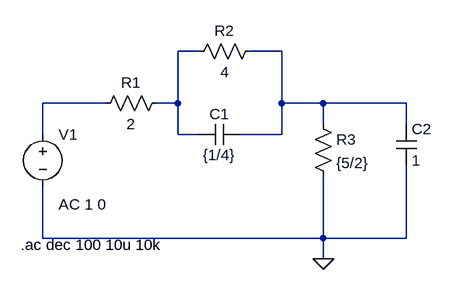
[diagram p0: schematic 2.asc]
2.asc, the LTspice schematic file:
Version 4
SHEET 1 880 680
WIRE 176 16 144 16
WIRE 304 16 256 16
WIRE 32 96 -64 96
WIRE 144 96 144 16
WIRE 144 96 112 96
WIRE 304 96 304 16
WIRE 368 96 304 96
WIRE 496 96 368 96
WIRE 368 128 368 96
WIRE 496 128 496 96
WIRE -64 144 -64 96
WIRE 144 144 144 96
WIRE 176 144 144 144
WIRE 304 144 304 96
WIRE 304 144 240 144
WIRE -64 304 -64 224
WIRE 368 304 368 208
WIRE 368 304 -64 304
WIRE 496 304 496 192
WIRE 496 304 368 304
WIRE 368 336 368 304
FLAG 368 336 0
SYMBOL res 128 80 R90
WINDOW 0 0 56 VBottom 2
WINDOW 3 32 56 VTop 2
SYMATTR InstName R1
SYMATTR Value 2
SYMBOL res 272 0 R90
WINDOW 0 0 56 VBottom 2
WINDOW 3 32 56 VTop 2
SYMATTR InstName R2
SYMATTR Value 4
SYMBOL cap 240 128 R90
WINDOW 0 0 32 VBottom 2
WINDOW 3 32 32 VTop 2
SYMATTR InstName C1
SYMATTR Value {1/4}
SYMBOL res 352 112 R0
SYMATTR InstName R3
SYMATTR Value {5/2}
SYMBOL cap 480 128 R0
SYMATTR InstName C2
SYMATTR Value 1
SYMBOL voltage -64 128 R0
WINDOW 123 24 124 Left 2
WINDOW 39 0 0 Left 0
SYMATTR InstName V1
SYMATTR Value ""
SYMATTR Value2 AC 1 0
TEXT -98 314 Left 2 !.ac dec 100 10u 10k

The netlist it stands for:
* 2.asc
R1 N001 N003 2
R2 N002 N001 4
C1 N002 N001 {1/4}
R3 N002 0 {5/2}
C2 N002 0 1
V1 N003 0 AC 1 0
.ac dec 100 10u 10k
.backanno
.end